# EAGLE design DL380P r1 Fan Control (EAGLE 9.6.2)
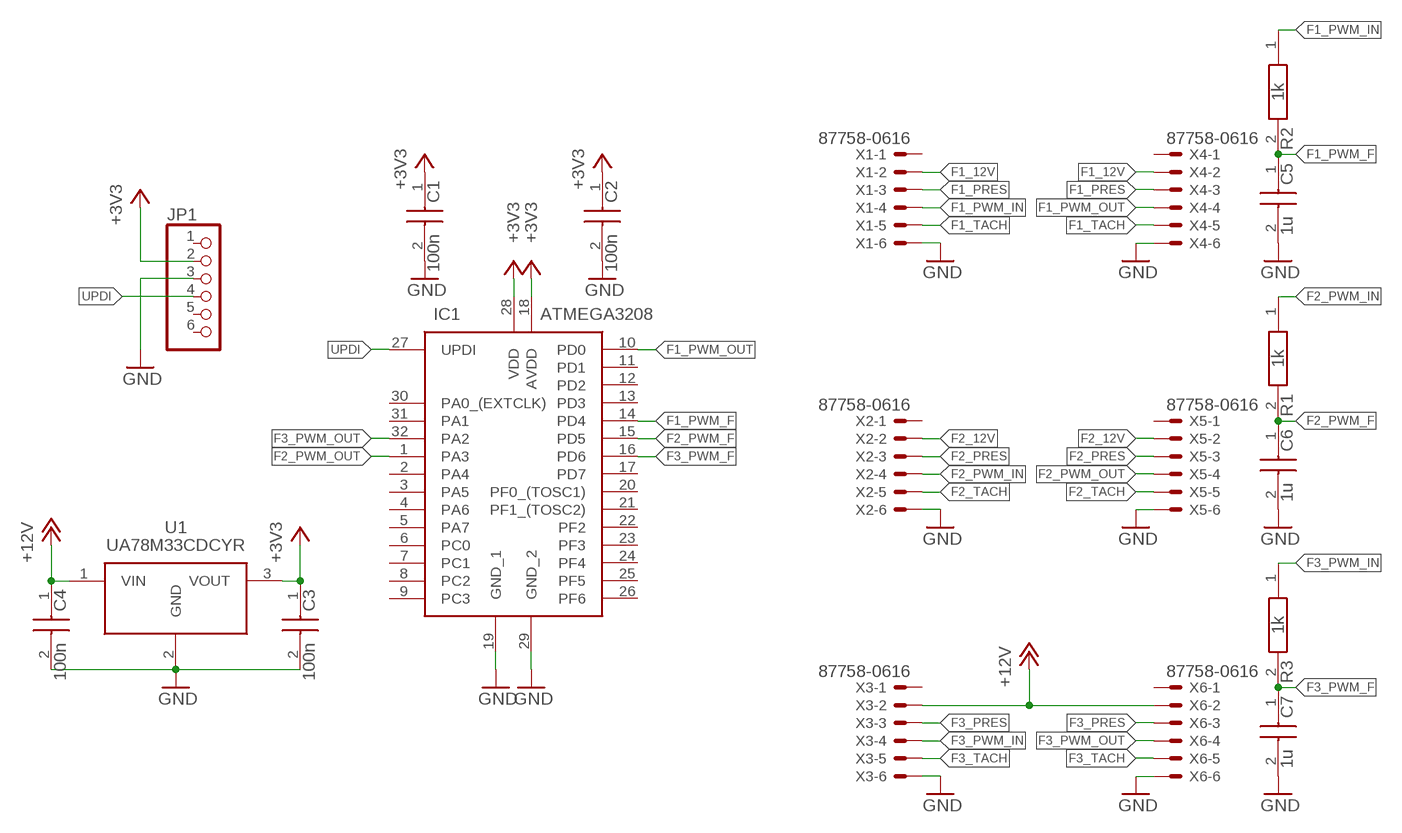
[diagram p0: schematic, sheet 1]

## Parts
C1  100n  _CAP_0603_100N_25V_10%_(X7R)  [CAPC1608X90N]
C2  100n  _CAP_0603_100N_25V_10%_(X7R)  [CAPC1608X90N]
C3  100n  _CAP_0603_100N_25V_10%_(X7R)  [CAPC1608X90N]
C4  100n  _CAP_0603_100N_25V_10%_(X7R)  [CAPC1608X90N]
C5  1u  _CAP_0603_1U_25V_10%_(X7R)  [CAPC1608X90N]
C6  1u  _CAP_0603_1U_25V_10%_(X7R)  [CAPC1608X90N]
C7  1u  _CAP_0603_1U_25V_10%_(X7R)  [CAPC1608X90N]
IC1  ATMEGA3208  _UC_ATMEGA3208-TQFP-32  [QFP80P900X900X120-32N]
JP1  PINHD-1X6LOCK  [1X06-BIGLOCK]
R1  1k  _RES_0603_1K_1/10W_1%_(RK73H1JTTD)  [RESC1608X55N]
R2  1k  _RES_0603_1K_1/10W_1%_(RK73H1JTTD)  [RESC1608X55N]
R3  1k  _RES_0603_1K_1/10W_1%_(RK73H1JTTD)  [RESC1608X55N]
U1  UA78M33CDCYR  _REG_3.3V_0.5A_SOT-223_(5.3-25V)_(UA78M33CDCYR)  [SOT230P700X180-4N]
X1  87758-0616  [87758-0616]
X2  87758-0616  [87758-0616]
X3  87758-0616  [87758-0616]
X4  87758-0616  [87758-0616]
X5  87758-0616  [87758-0616]
X6  87758-0616  [87758-0616]

## Nets
+3V3: C1.1 C2.1 C3.1 IC1.18(AVDD) IC1.28(VDD) JP1.2 U1.3(VOUT)
+12V: C4.1 U1.1(VIN) X3.2 X6.2
F1_12V: X1.2 X4.2
F1_PRES: X1.3 X4.3
F1_PWM_F: C5.1 IC1.14(PD4) R2.2
F1_PWM_IN: R2.1 X1.4
F1_PWM_OUT: IC1.10(PD0) X4.4
F1_TACH: X1.5 X4.5
F2_12V: X2.2 X5.2
F2_PRES: X2.3 X5.3
F2_PWM_F: C6.1 IC1.15(PD5) R1.2
F2_PWM_IN: R1.1 X2.4
F2_PWM_OUT: IC1.1(PA3) X5.4
F2_TACH: X2.5 X5.5
F3_PRES: X3.3 X6.3
F3_PWM_F: C7.1 IC1.16(PD6) R3.2
F3_PWM_IN: R3.1 X3.4
F3_PWM_OUT: IC1.32(PA2) X6.4
F3_TACH: X3.5 X6.5
GND: C1.2 C2.2 C3.2 C4.2 C5.2 C6.2 C7.2 IC1.19(GND_1) IC1.29(GND_2) JP1.3 U1.2(GND) U1.4(GND_1) X1.6 X2.6 X3.6 X4.6 X5.6 X6.6
UPDI: IC1.27(UPDI) JP1.4
Unconnected: IC1.2(PA4) IC1.3(PA5) IC1.4(PA6) IC1.5(PA7) IC1.6(PC0) IC1.7(PC1) IC1.8(PC2) IC1.9(PC3) IC1.11(PD1) IC1.12(PD2) IC1.13(PD3) IC1.17(PD7) IC1.20(PF0_(TOSC1)) IC1.21(PF1_(TOSC2)) IC1.22(PF2) IC1.23(PF3) IC1.24(PF4) IC1.25(PF5) IC1.26(PF6) IC1.30(PA0_(EXTCLK)) IC1.31(PA1) JP1.1 JP1.5 JP1.6 X1.1 X2.1 X3.1 X4.1 X5.1 X6.1

## Library data of the parts
C1-C4 = SamacSys_Parts:_CAP_0603_100N_25V_10%_(X7R): Capacitor MLCC 0603 100nF 25V AVX 0603 Standard 100nF Ceramic Multilayer Capacitor, 25 V dc, +125C, X7R Dielectric, +/-10% SMD Source: Datasheet; DESCRIPTION: Capacitor MLCC 0603 100nF 25V AVX 0603 Standard 100nF Ceramic Multilayer Capacitor, 25 V dc, +125C, X7R Dielectric, +/-10% SMD; HEIGHT: 0.9mm; MANUFACTURER_NAME: AVX; MANUFACTURER_PART_NUMBER: 06033C104KAT2A; MOUSER_PART_NUMBER: 581-06033C104KAT2A; MOUSER_PRICE-STOCK: https://www.mouser.co.uk/ProductDetail/AVX/06033C104KAT2A?qs=gPDEucxdFwYuZhv3uXRdIw%3D%3D
C5-C7 = SamacSys_Parts:_CAP_0603_1U_25V_10%_(X7R): Multilayer Ceramic Capacitors MLCC - SMD/SMT 25V 1uF X7R 0603 10% Tol Source: Datasheet; DESCRIPTION: Multilayer Ceramic Capacitors MLCC - SMD/SMT 25V 1uF X7R 0603 10% Tol; HEIGHT: 0.9mm; MANUFACTURER_NAME: AVX; MANUFACTURER_PART_NUMBER: 06033C105KAT2A; MOUSER_PART_NUMBER: 581-06033C105KAT2A; MOUSER_PRICE-STOCK: https://www.mouser.co.uk/ProductDetail/AVX/06033C105KAT2A?qs=WJDKaGZ8K%252B74iIXLYpbr1A%3D%3D
IC1 = SamacSys_Parts:_UC_ATMEGA3208-TQFP-32: 8-bit Microcontrollers - MCU 20MHz, 32KB, TQFP32, Ind 125C, Green, T&R Source: Datasheet; DESCRIPTION: 8-bit Microcontrollers - MCU 20MHz, 32KB, TQFP32, Ind 125C, Green, T&R; HEIGHT: 1.2mm; MANUFACTURER_NAME: Microchip; MANUFACTURER_PART_NUMBER: ATMEGA3208-AFR; MOUSER_PART_NUMBER: 579-ATMEGA3208AFR; MOUSER_PRICE-STOCK: https://www.mouser.co.uk/ProductDetail/Microchip-Technology-Atmel/ATMEGA3208-AFR?qs=y6ZabgHbY%252ByqMua8ssBYRQ%3D%3D
JP1 = adafruit:PINHD-1X6: PIN HEADER
R1-R3 = SamacSys_Parts:_RES_0603_1K_1/10W_1%_(RK73H1JTTD): Thick Film Resistors - SMD 1/10watts 1Kohms 1% Source: Datasheet <https://componentsearchengine.com/Datasheets/1/RK73H1JTTDD1001F.pdf>; DESCRIPTION: Thick Film Resistors - SMD 1/10watts 1Kohms 1%; HEIGHT: 0.55mm; MANUFACTURER_NAME: KOA Speer; MANUFACTURER_PART_NUMBER: RK73H1JTTDD1001F; MOUSER_PART_NUMBER: 660-RK73H1JTTDD1001F; MOUSER_PRICE-STOCK: https://www.mouser.com/Search/Refine.aspx?Keyword=660-RK73H1JTTDD1001F
U1 = SamacSys_Parts:_REG_3.3V_0.5A_SOT-223_(5.3-25V)_(UA78M33CDCYR): 500-mA, 25-V, Linear Voltage Regulators Source: Datasheet <http://www.ti.com/lit/gpn/ua78m>; DESCRIPTION: 500-mA, 25-V, Linear Voltage Regulators; HEIGHT: 1.8mm; MANUFACTURER_NAME: Texas Instruments; MANUFACTURER_PART_NUMBER: UA78M33CDCYR; MOUSER_PART_NUMBER: 595-UA78M33CDCYR; MOUSER_PRICE-STOCK: https://www.mouser.co.uk/ProductDetail/Texas-Instruments/UA78M33CDCYR?qs=LfG3tU9ud8DRKHAAx6wmNw%3D%3D
X1-X6 = con-molex:87758-0616: 6 Pin - 2mm Dual Row Single Wafer, Vertical T/H HDR Source: http://www.molex.com/pdm_docs/sd/877580616_sd.pdf; MF: MOLEX; MPN: 87758-0616; OC_FARNELL: 7472323; OC_NEWARK: 25M5667

## Board
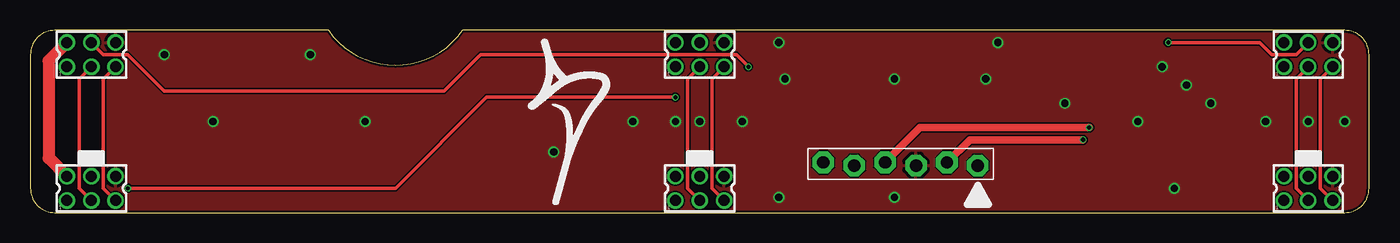
[diagram p1: board, top side]
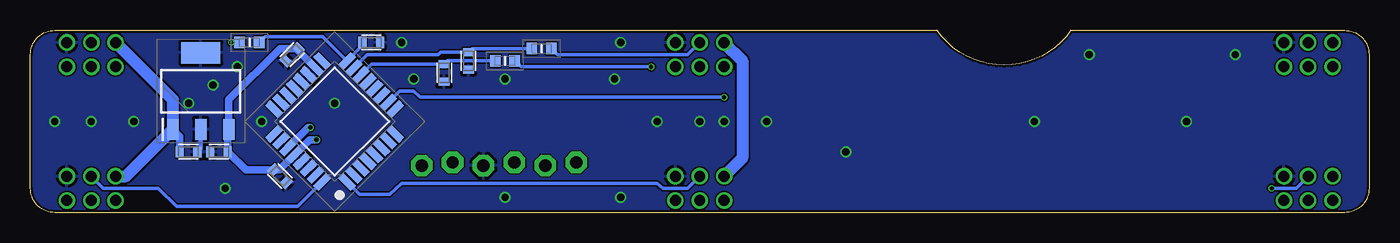
[diagram p2: board, bottom side, seen from below]

Size 110 x 15 mm. Coordinates in mm from the lower left corner, seen from the top.
Outline: 0,13 0,2 arc90 2,0 108,0 arc90 110,2 110,13 arc90 108,15 35.5,15 arc-110 24.5,15 2,15 arc90 0,13
Copper layers (1*16): Top 0.035559375mm / dielectric 1.6mm / Bottom 0.035559375mm
Design rules "JLCPCB 2-Layer": minimum track width 5mil, minimum drill 12mil, track to track 5mil, track to pad 5mil, pad to pad 5mil, via to via 5mil, smd to smd 5mil, copper to edge 8mil, drill to drill 6mil, minimum pad ring 5mil, minimum via ring 3mil, stop-mask expansion 2.5mil, vias tented up to drill 30mil, thermal gap 10mil

### Footprints (pad centres in the part's own frame; a part is rotated, then mirrored left to right if it is on the bottom)
CAPC1608X90N = smd 0.662 x 0.922: 1 -0.725,0; 2 0.725,0
QFP80P900X900X120-32N = smd 1.475 x 0.6: 1 -4.238,2.8; 2 -4.238,2; 3 -4.238,1.2; 4 -4.238,0.4; 5 -4.238,-0.4; 6 -4.238,-1.2; 7 -4.238,-2; 8 -4.238,-2.8; 17 4.238,-2.8; 18 4.238,-2; 19 4.238,-1.2; 20 4.238,-0.4; 21 4.238,0.4; 22 4.238,1.2; 23 4.238,2; 24 4.238,2.8 | smd 0.6 x 1.475: 9 -2.8,-4.238; 10 -2,-4.238; 11 -1.2,-4.238; 12 -0.4,-4.238; 13 0.4,-4.238; 14 1.2,-4.238; 15 2,-4.238; 16 2.8,-4.238; 25 2.8,4.238; 26 2,4.238; 27 1.2,4.238; 28 0.4,4.238; 29 -0.4,4.238; 30 -1.2,4.238; 31 -2,4.238; 32 -2.8,4.238
1X06-BIGLOCK = drill 1.016 pad 1.778 octagon: 1 -6.35,0.127; 2 -3.81,-0.127; 3 -1.27,0.127; 4 1.27,-0.127; 5 3.81,0.127; 6 6.35,-0.127
RESC1608X55N = smd 0.9 x 0.95: 1 -0.8,0; 2 0.8,0
SOT230P700X180-4N = smd 1.75 x 0.95: 1 -3.15,2.3; 2 -3.15,0; 3 -3.15,-2.3 | smd 1.75 x 3.2: 4 3.15,0
87758-0616 = drill 0.9 pad 1.27: 1 -2,-1; 2 -2,1; 3 0,-1; 4 0,1; 5 2,-1; 6 2,1

### Placement (x,y rotation side)
C1  94.5,5 180 bottom
C2  89.5,3 315 bottom
C3  88.5,13 225 bottom
C4  97,5 0 bottom
C5  76,11.5 270 bottom
C6  74,12.5 270 bottom
C7  82,14 0 bottom
IC1  85,7.5 135 bottom
JP1  71.5,4 180 top
R1  68,13.5 180 bottom
R2  71,12.5 180 bottom
R3  92,14 0 bottom
U1  96,10 90 bottom
X1  5,13 0 top
X2  55,13 0 top
X3  105,13 0 top
X4  5,2 0 top
X5  55,2 0 top
X6  105,2 0 top

### Tracks (layer width: path | path; a pad name or v marks a point on that pad's centre or on a via)
+3V3  (via drill 0.35)
  Top 0.6: v86.5,6 77.18,6 JP1.2
  Bottom 0.6: IC1.18 87.99,13.32 C3.1 89.49,13.51 93.7,9.3 U1.3 93.78,6.78 C1.1 92.29,3.51 C2.1 89.55,3.51 IC1.28 87.07,6 v86.5,6
+12V
  Bottom 0.6: C4.1 97.72,6.28 U1.1
  Bottom 1: X3.2 98.3,9.3 U1.1 102.15,3 X6.2
F1_12V
  Top 1: X1.2 1.5,12.5 1.5,4.5 X4.2
F1_PRES
  Top 0.3: X1.3 4,11 4,2 X4.3
F1_PWM_F
  Bottom 0.3: R2.2 74.5,12.5 75.72,12.5 C5.1 81.97,12.22 IC1.14
F1_PWM_IN  (via drill 0.35)
  Top 0.3: v59,12 58,13 37,13 34,10 11,10 8,13 6,13 X1.4
  Bottom 0.3: R2.1 69.7,12 v59,12
F1_PWM_OUT  (via drill 0.35)
  Top 0.3: v53,9.5 37.5,9.5 30,2 v8,2
  Bottom 0.3: v8,2 6,2 X4.4 | v53,9.5 78,9.5 78.5,10 79.67,10 IC1.10
F1_TACH
  Top 0.3: X4.5 6,2 6,11 X1.5
F2_12V
  Bottom 1: X2.2 51.5,12.5 51.5,4.5 X5.2
F2_PRES
  Top 0.3: X5.3 54,2 54,11 X2.3
F2_PWM_F
  Bottom 0.3: R1.2 73.72,13.5 C6.1 76.28,13.22 76.5,13 82.33,13 IC1.15
F2_PWM_IN
  Bottom 0.3: X2.4 56,13 66.7,13 R1.1
F2_PWM_OUT
  Bottom 0.3: IC1.1 82.96,1.5 80.5,1.5 79.5,2.42 58.5,2.42 58,2 56,2 X5.4
F2_TACH
  Top 0.3: X2.5 56,11 56,2 X5.5
F3_PRES
  Top 0.3: X3.3 104,11 104,2 X6.3
F3_PWM_F
  Bottom 0.3: C7.1 82.72,13.73 IC1.16 86.01,14.5 90.7,14.5 R3.2
F3_PWM_IN  (via drill 0.35)
  Top 0.3: v93.5,14 101,14 102,13 104,13 X3.4
  Bottom 0.3: R3.1 v93.5,14
F3_PWM_OUT
  Bottom 0.3: IC1.32 88.04,0.5 98,0.5 99.5,2 104,2 X6.4
F3_TACH
  Top 0.3: X3.5 106,11 106,2 X6.5
GND  (via drill 0.6)
  Bottom 0.35: U1.2 96,5.28 C4.2
  other vias: 108,7.5 101.5,7.5 105,7.5 94,2 91,7.5 85,9 58.5,7.5 43,5 15,7.5 61.5,1.25 71,1.25 61.5,14 62,11 71,11 55,7.5 11,13 23,13 49.5,7.5 53,7.5 95,10.5 78.5,11 93,12 97,9 27.5,7.5 79.5,14
  pour Bottom: 0,0 0,15 110,15 110,0
  pour Top: 0,0 0,15 110,15 110,0
UPDI  (via drill 0.35)
  Top 0.6: JP1.4 73.1,7 v87,7
  Bottom 0.6: IC1.27 87.2,7 v87,7